# EasyEDA schematic CESC16.json

## Sheets
1 PSU: TITLE: PSU (Power Supply); REV: 1.0; Date: 2020-07-09; Sheet: 1/1
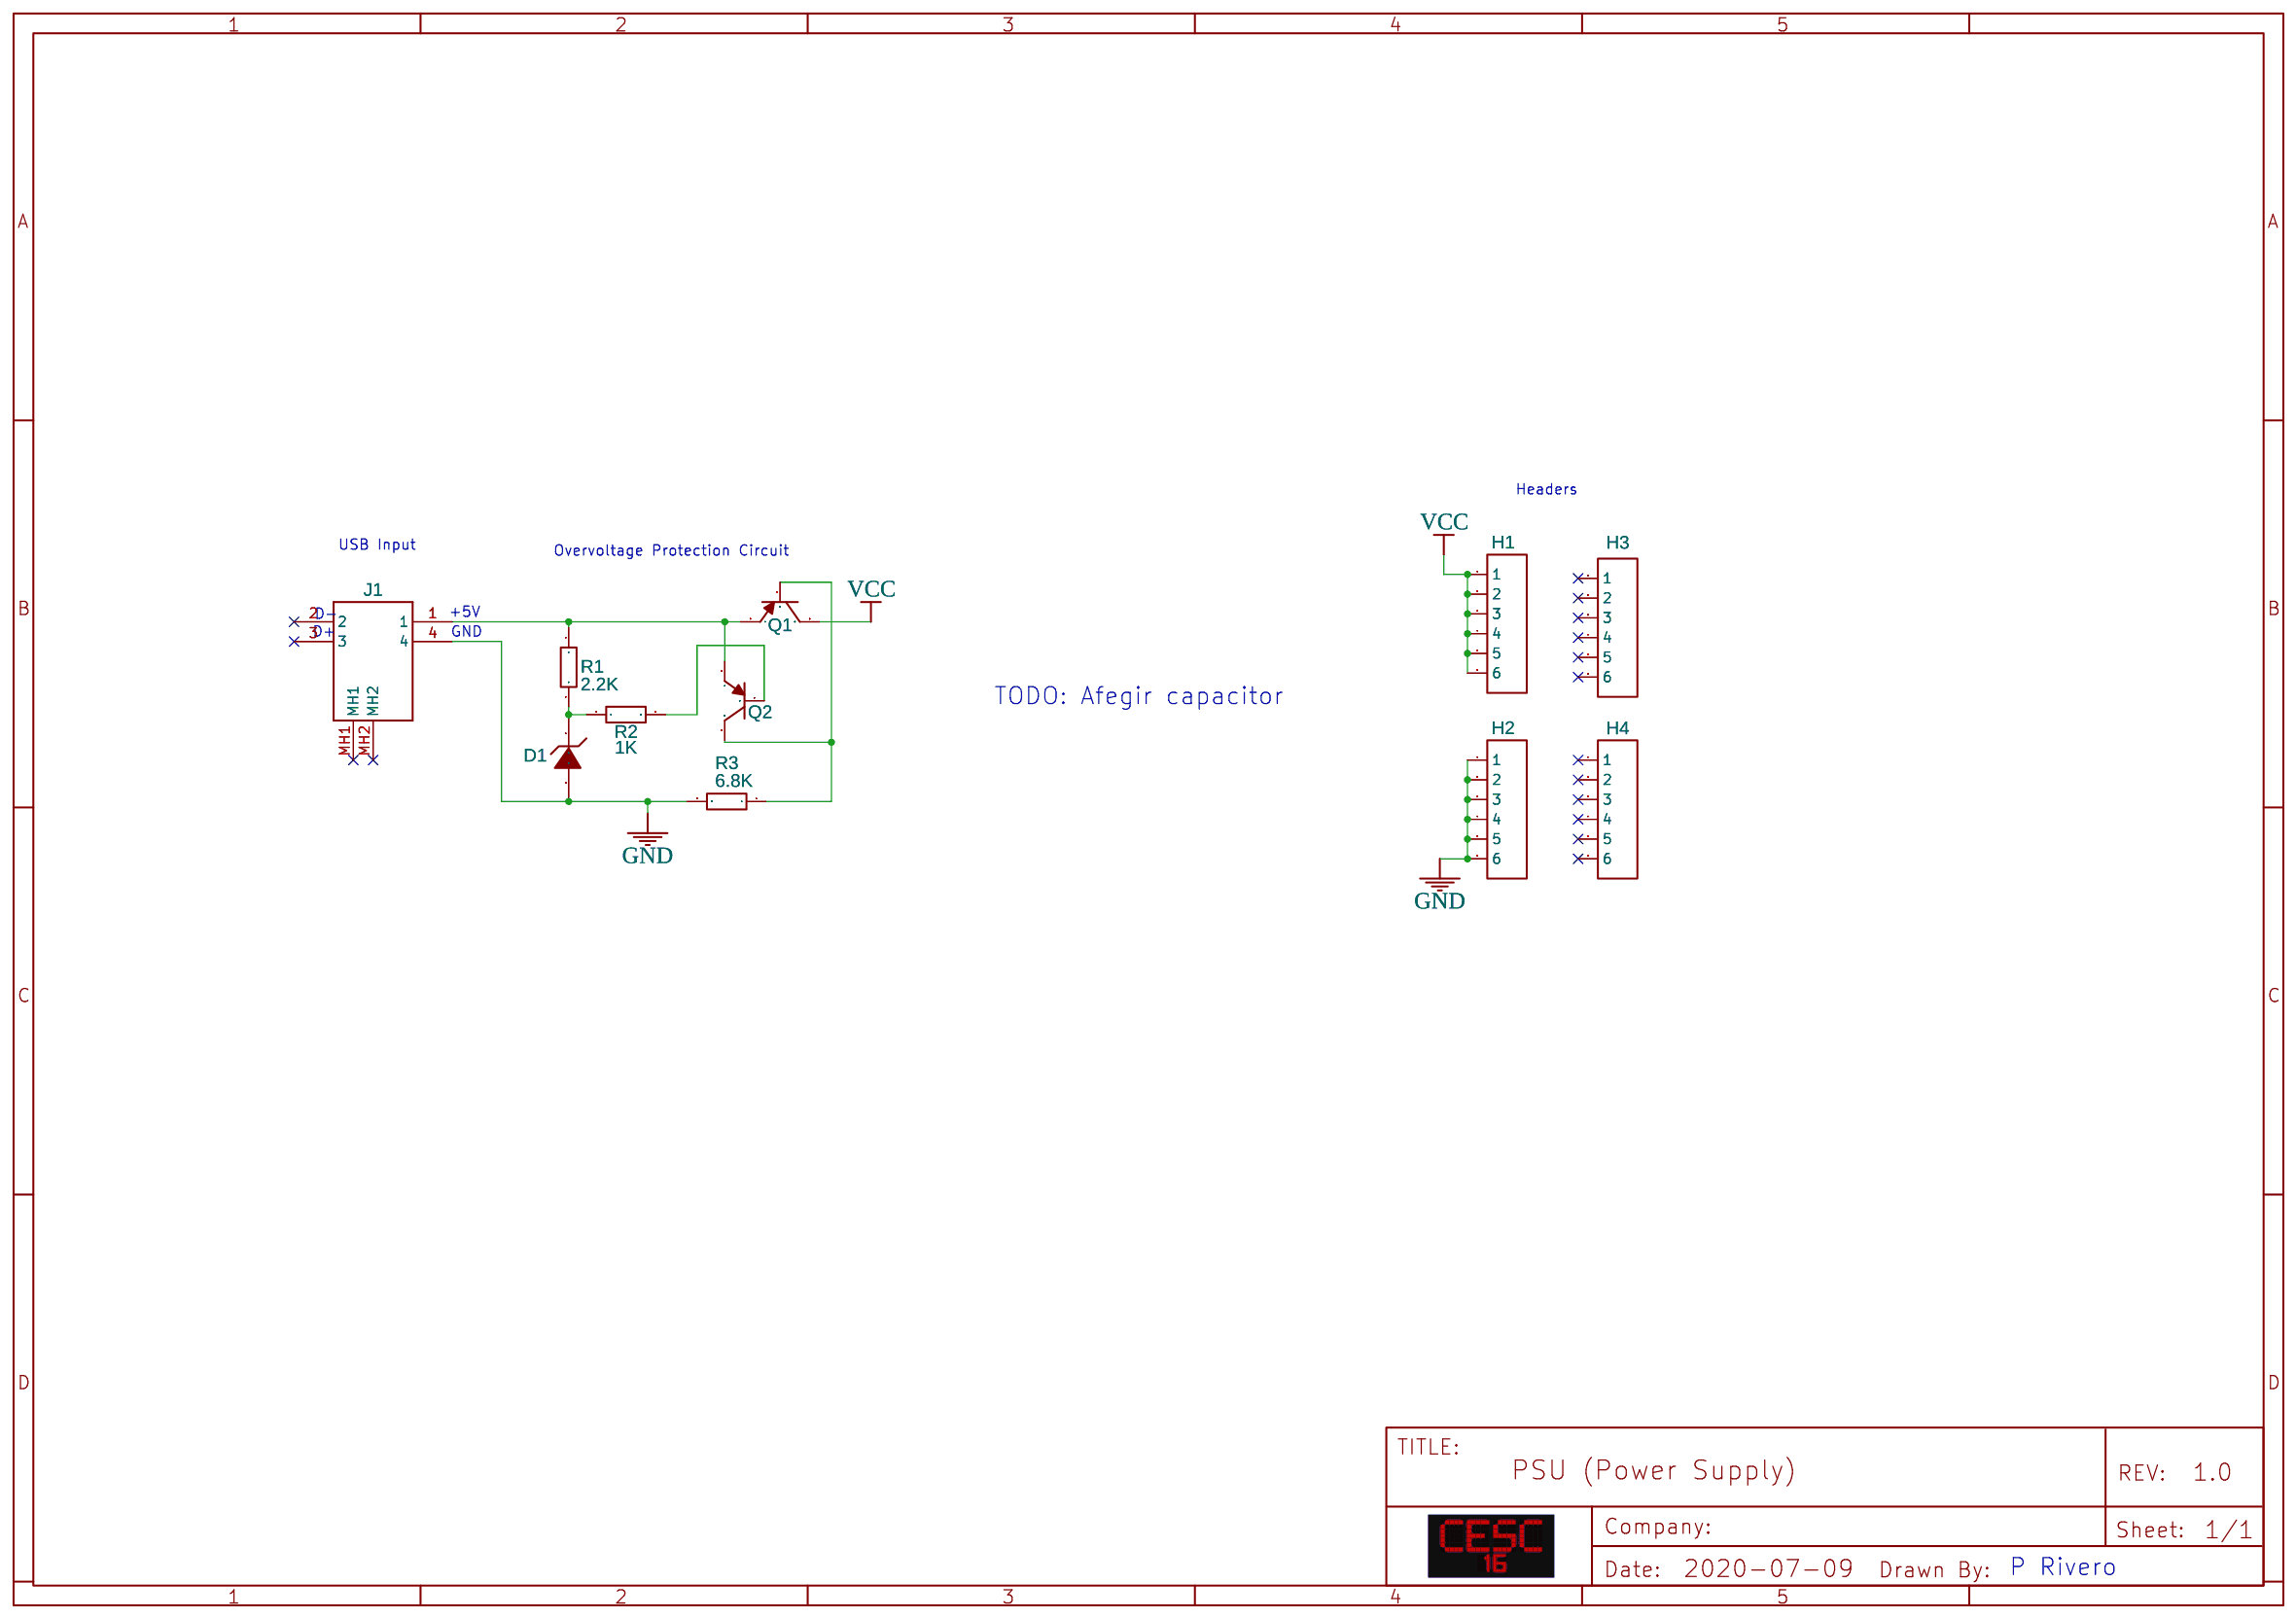
[diagram p0: PSU]
2 _Template: TITLE: Title; Date: 2020-MM-DD
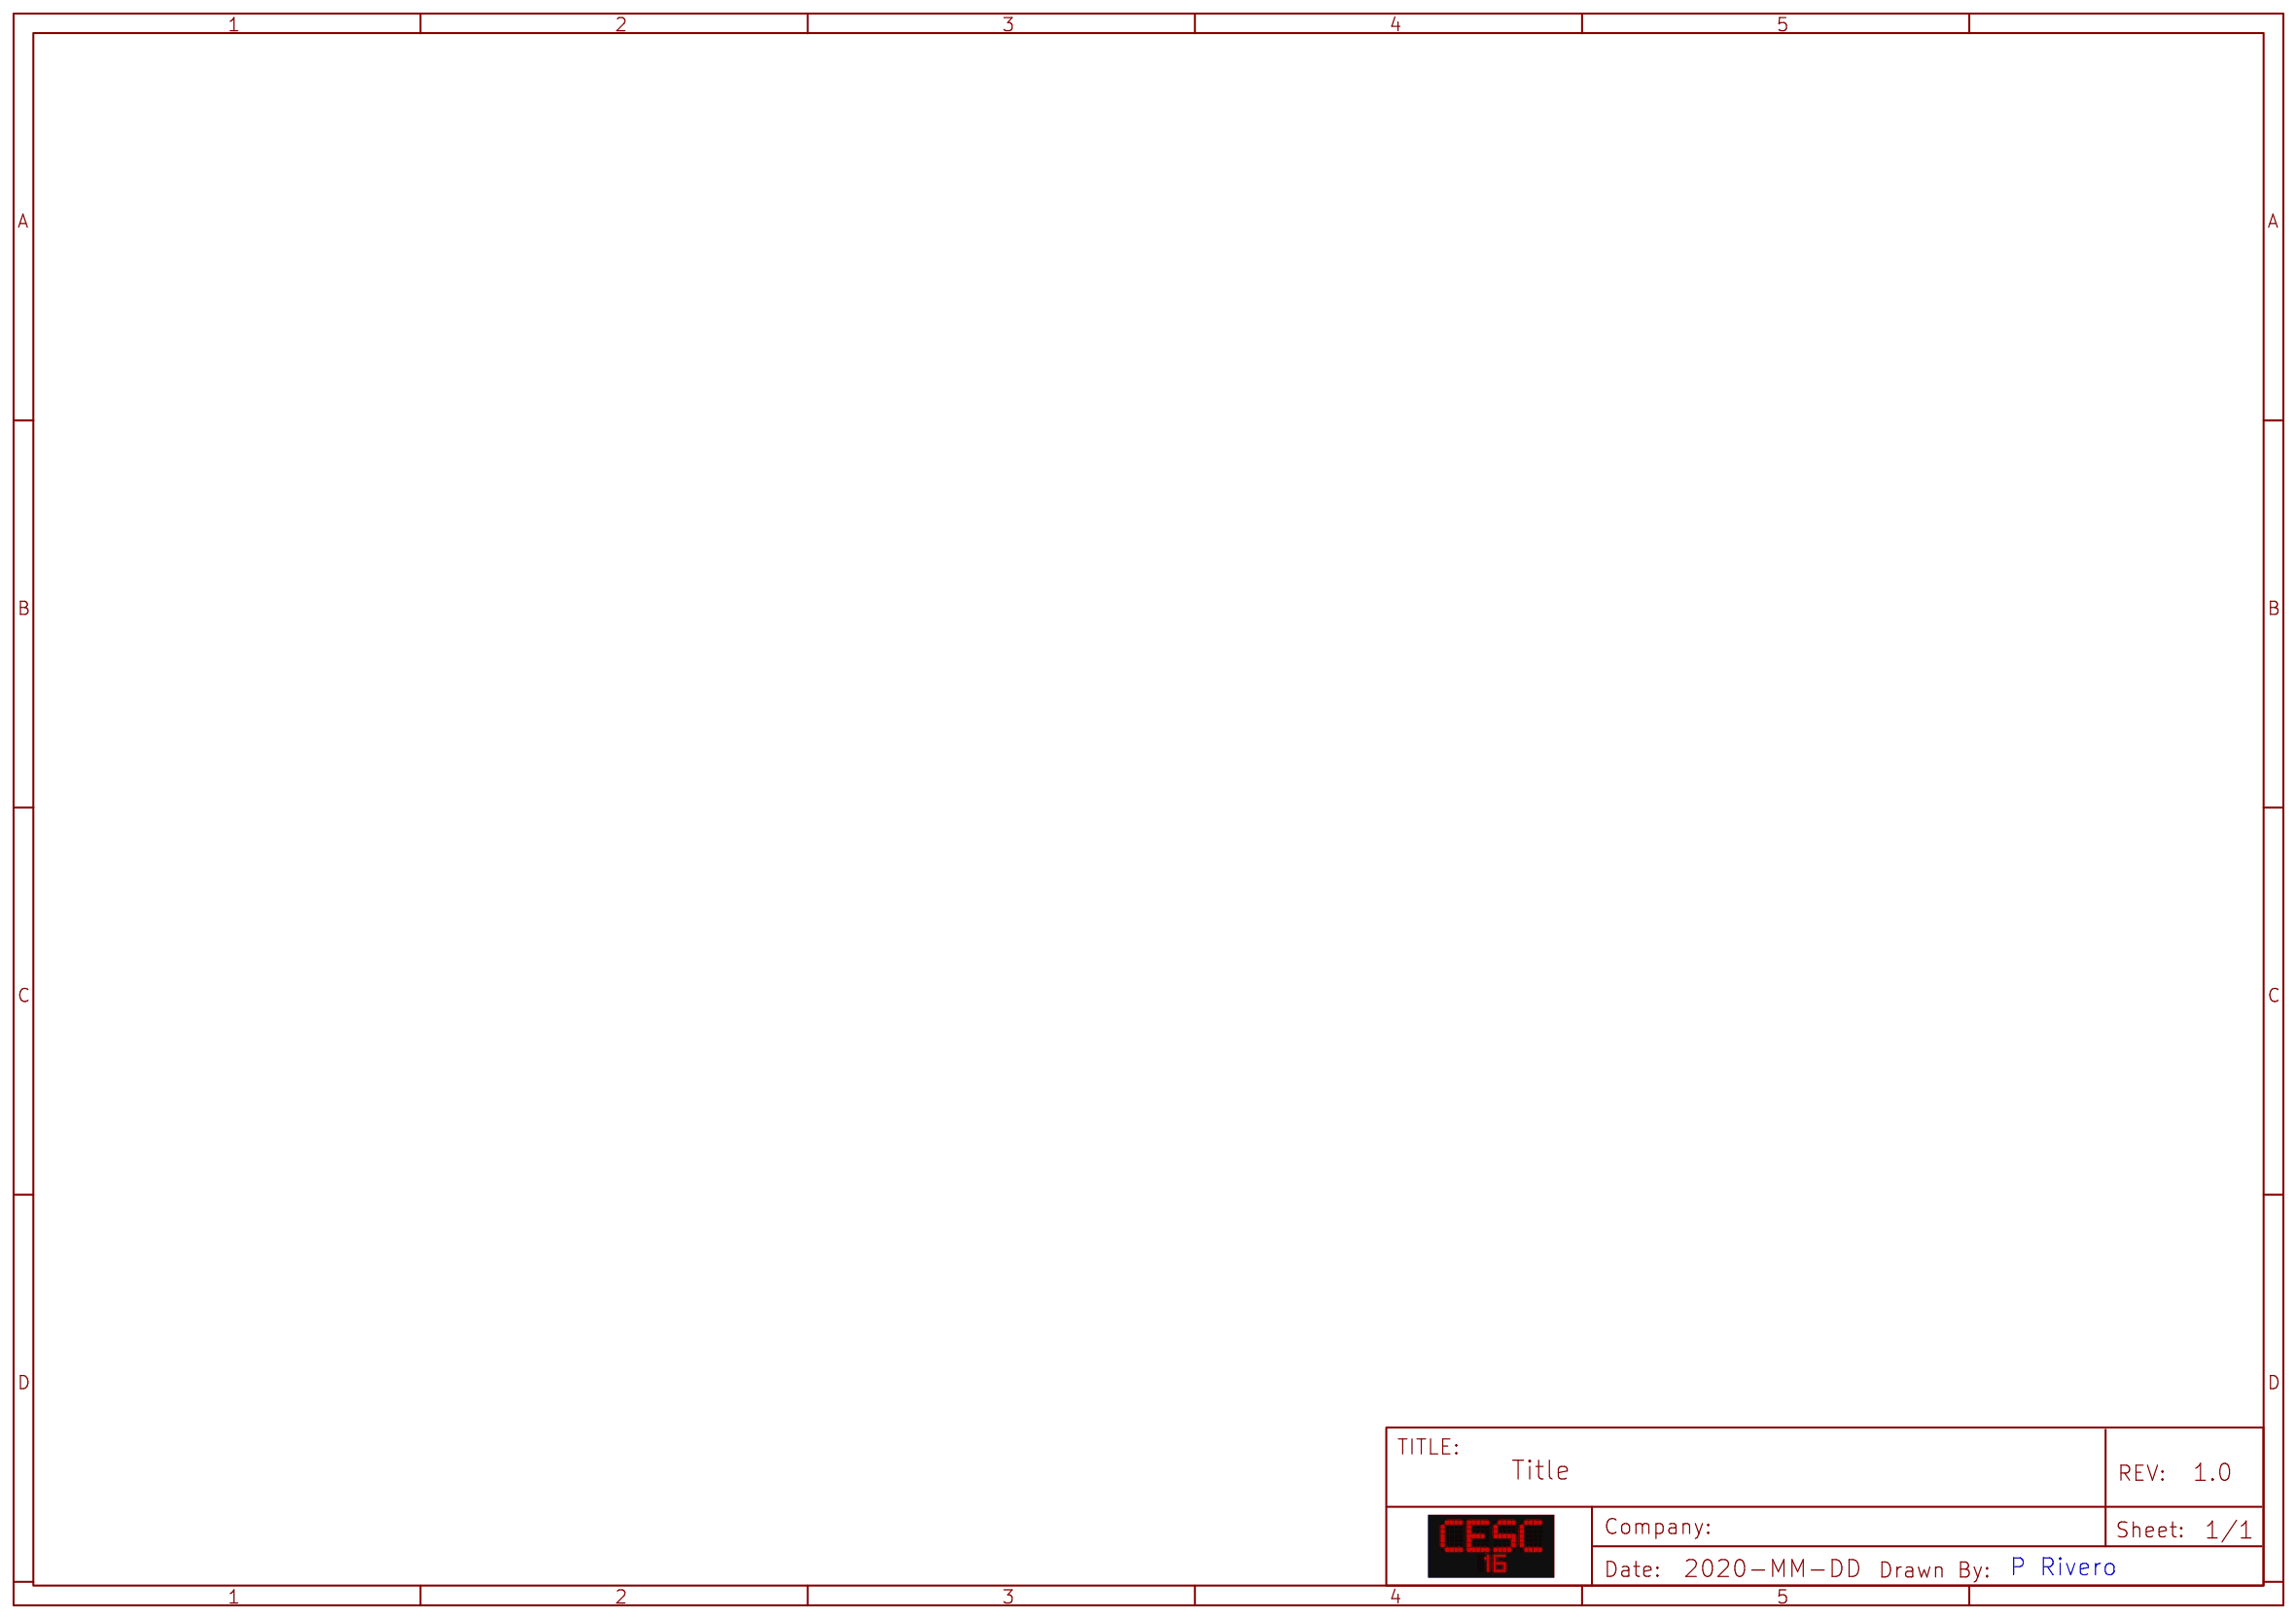
[diagram p1: _Template]
3 ALU: TITLE: ALU (Arithmetic & Logic Unit); Date: 2020-MM-DD
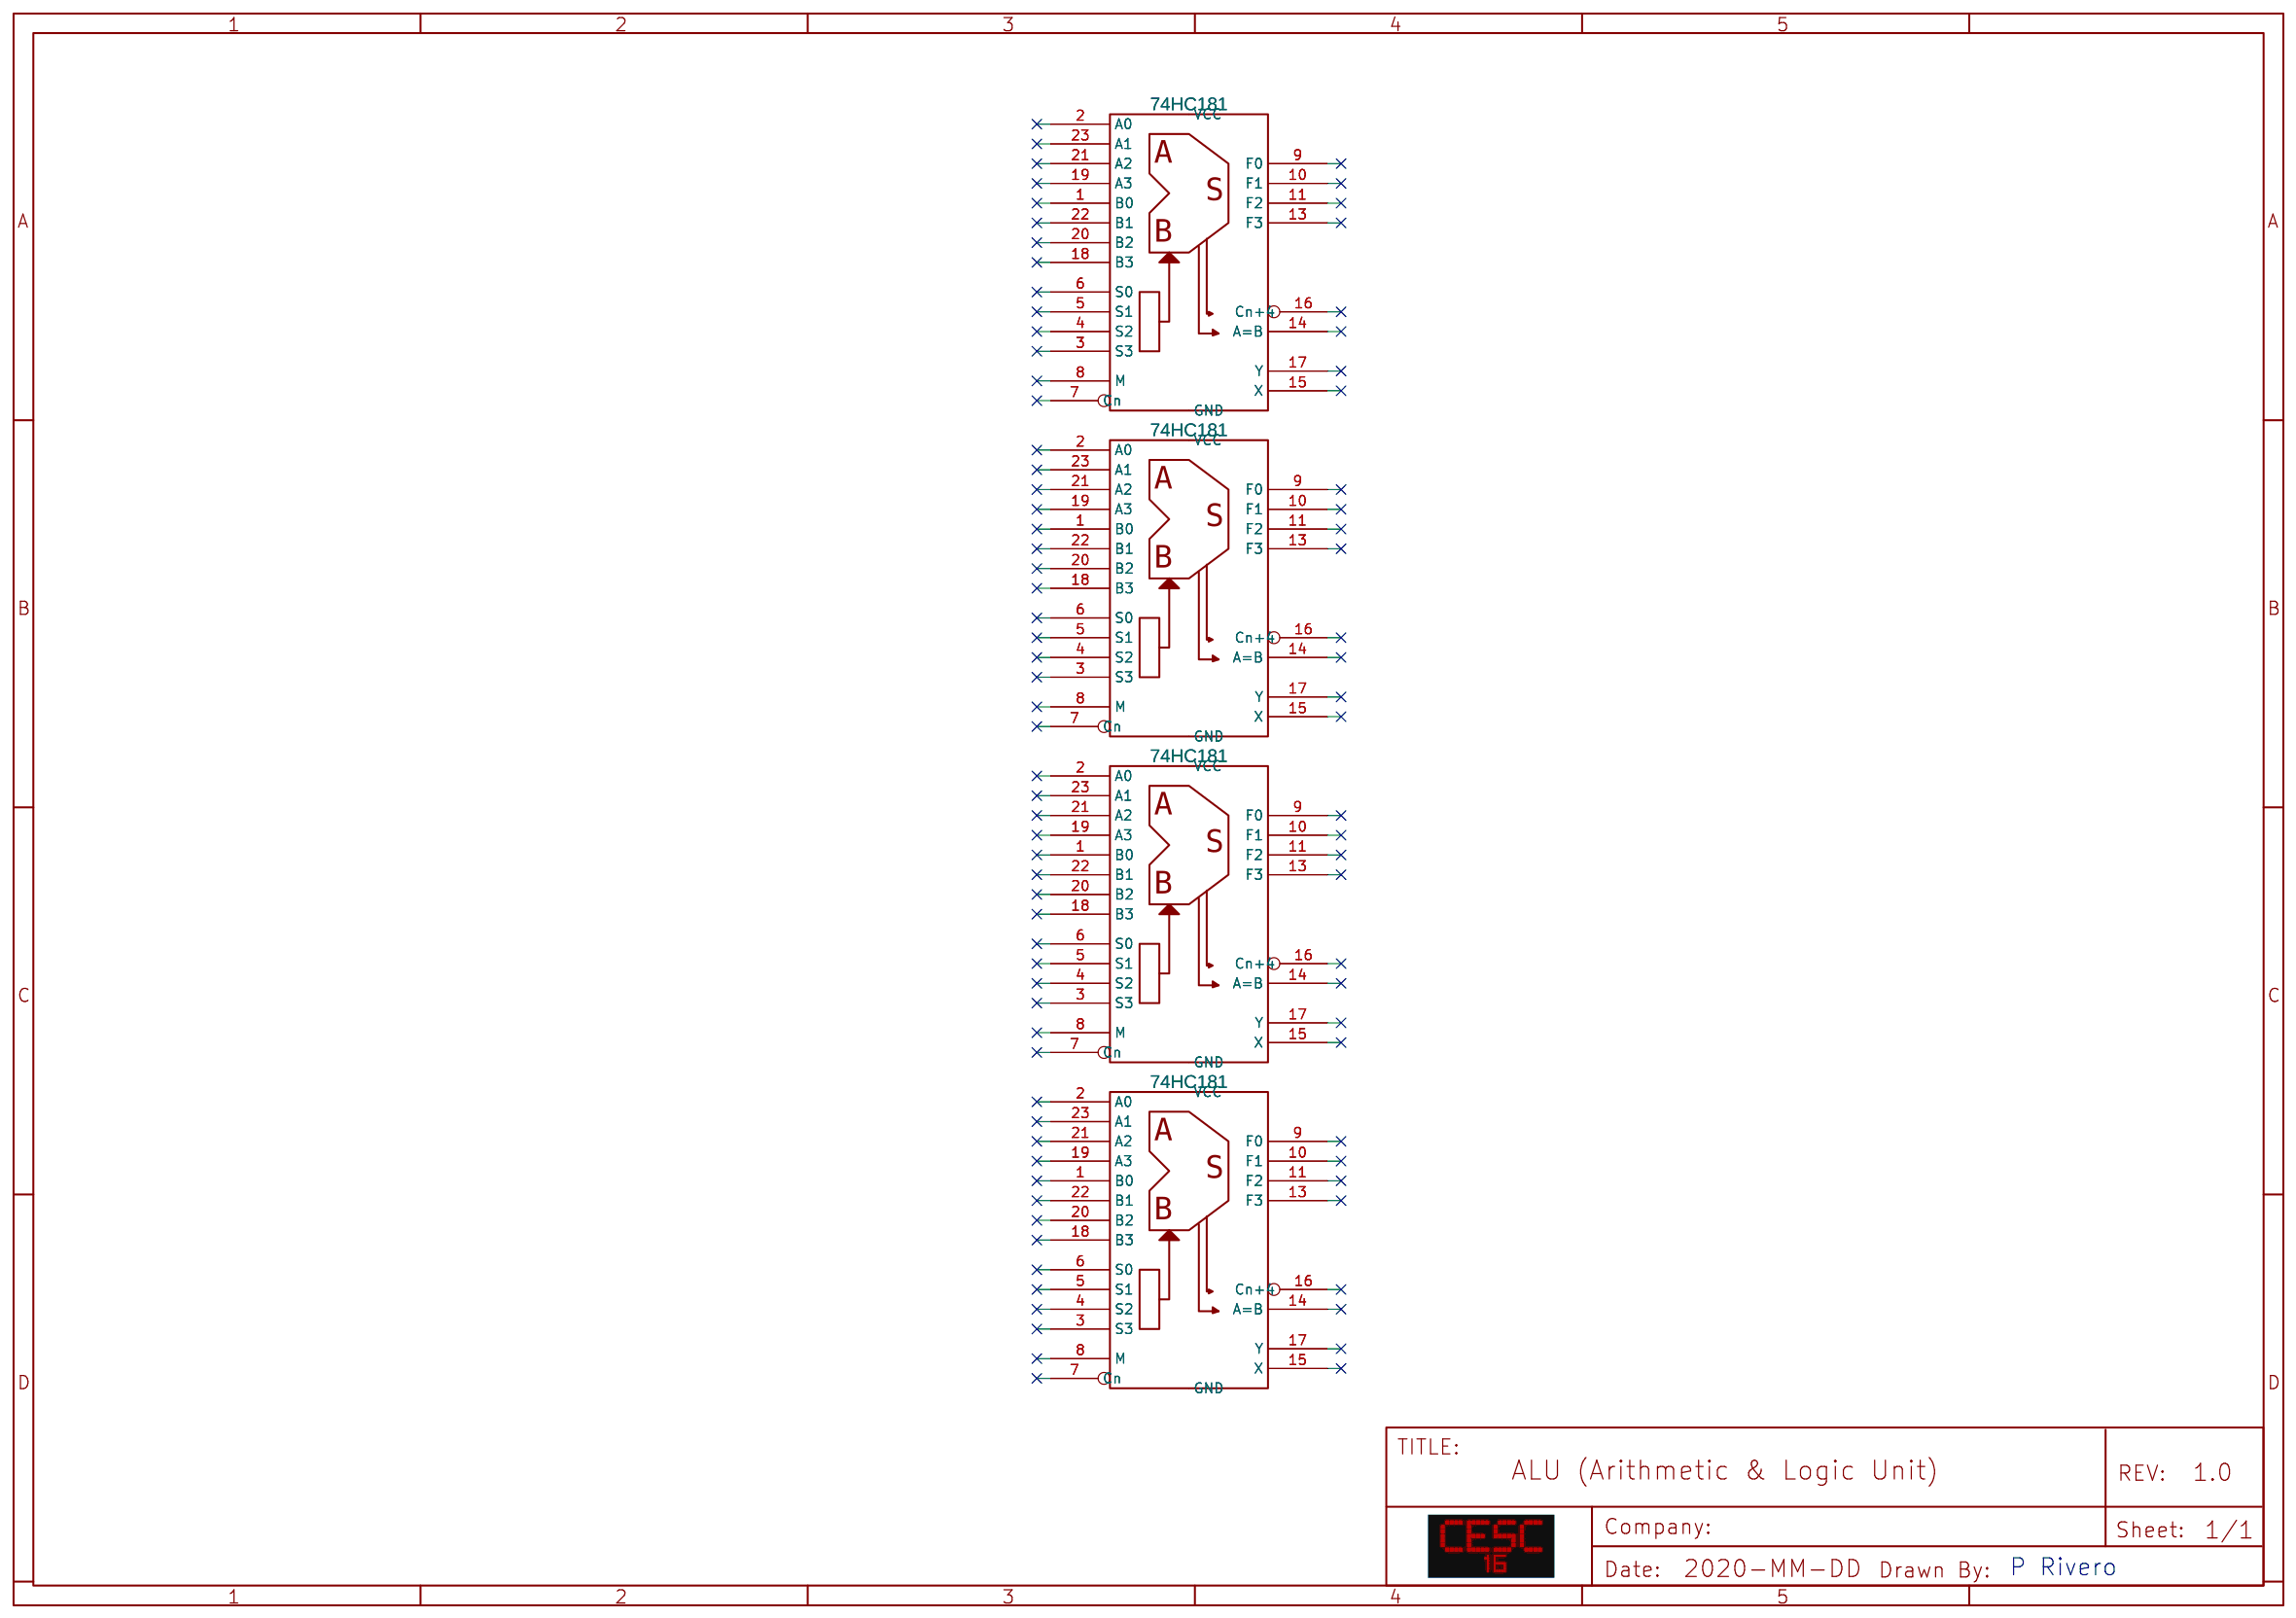
[diagram p2: ALU]
4 GPR: TITLE: GPR (General Purpose Register); Date: 2020-7-21
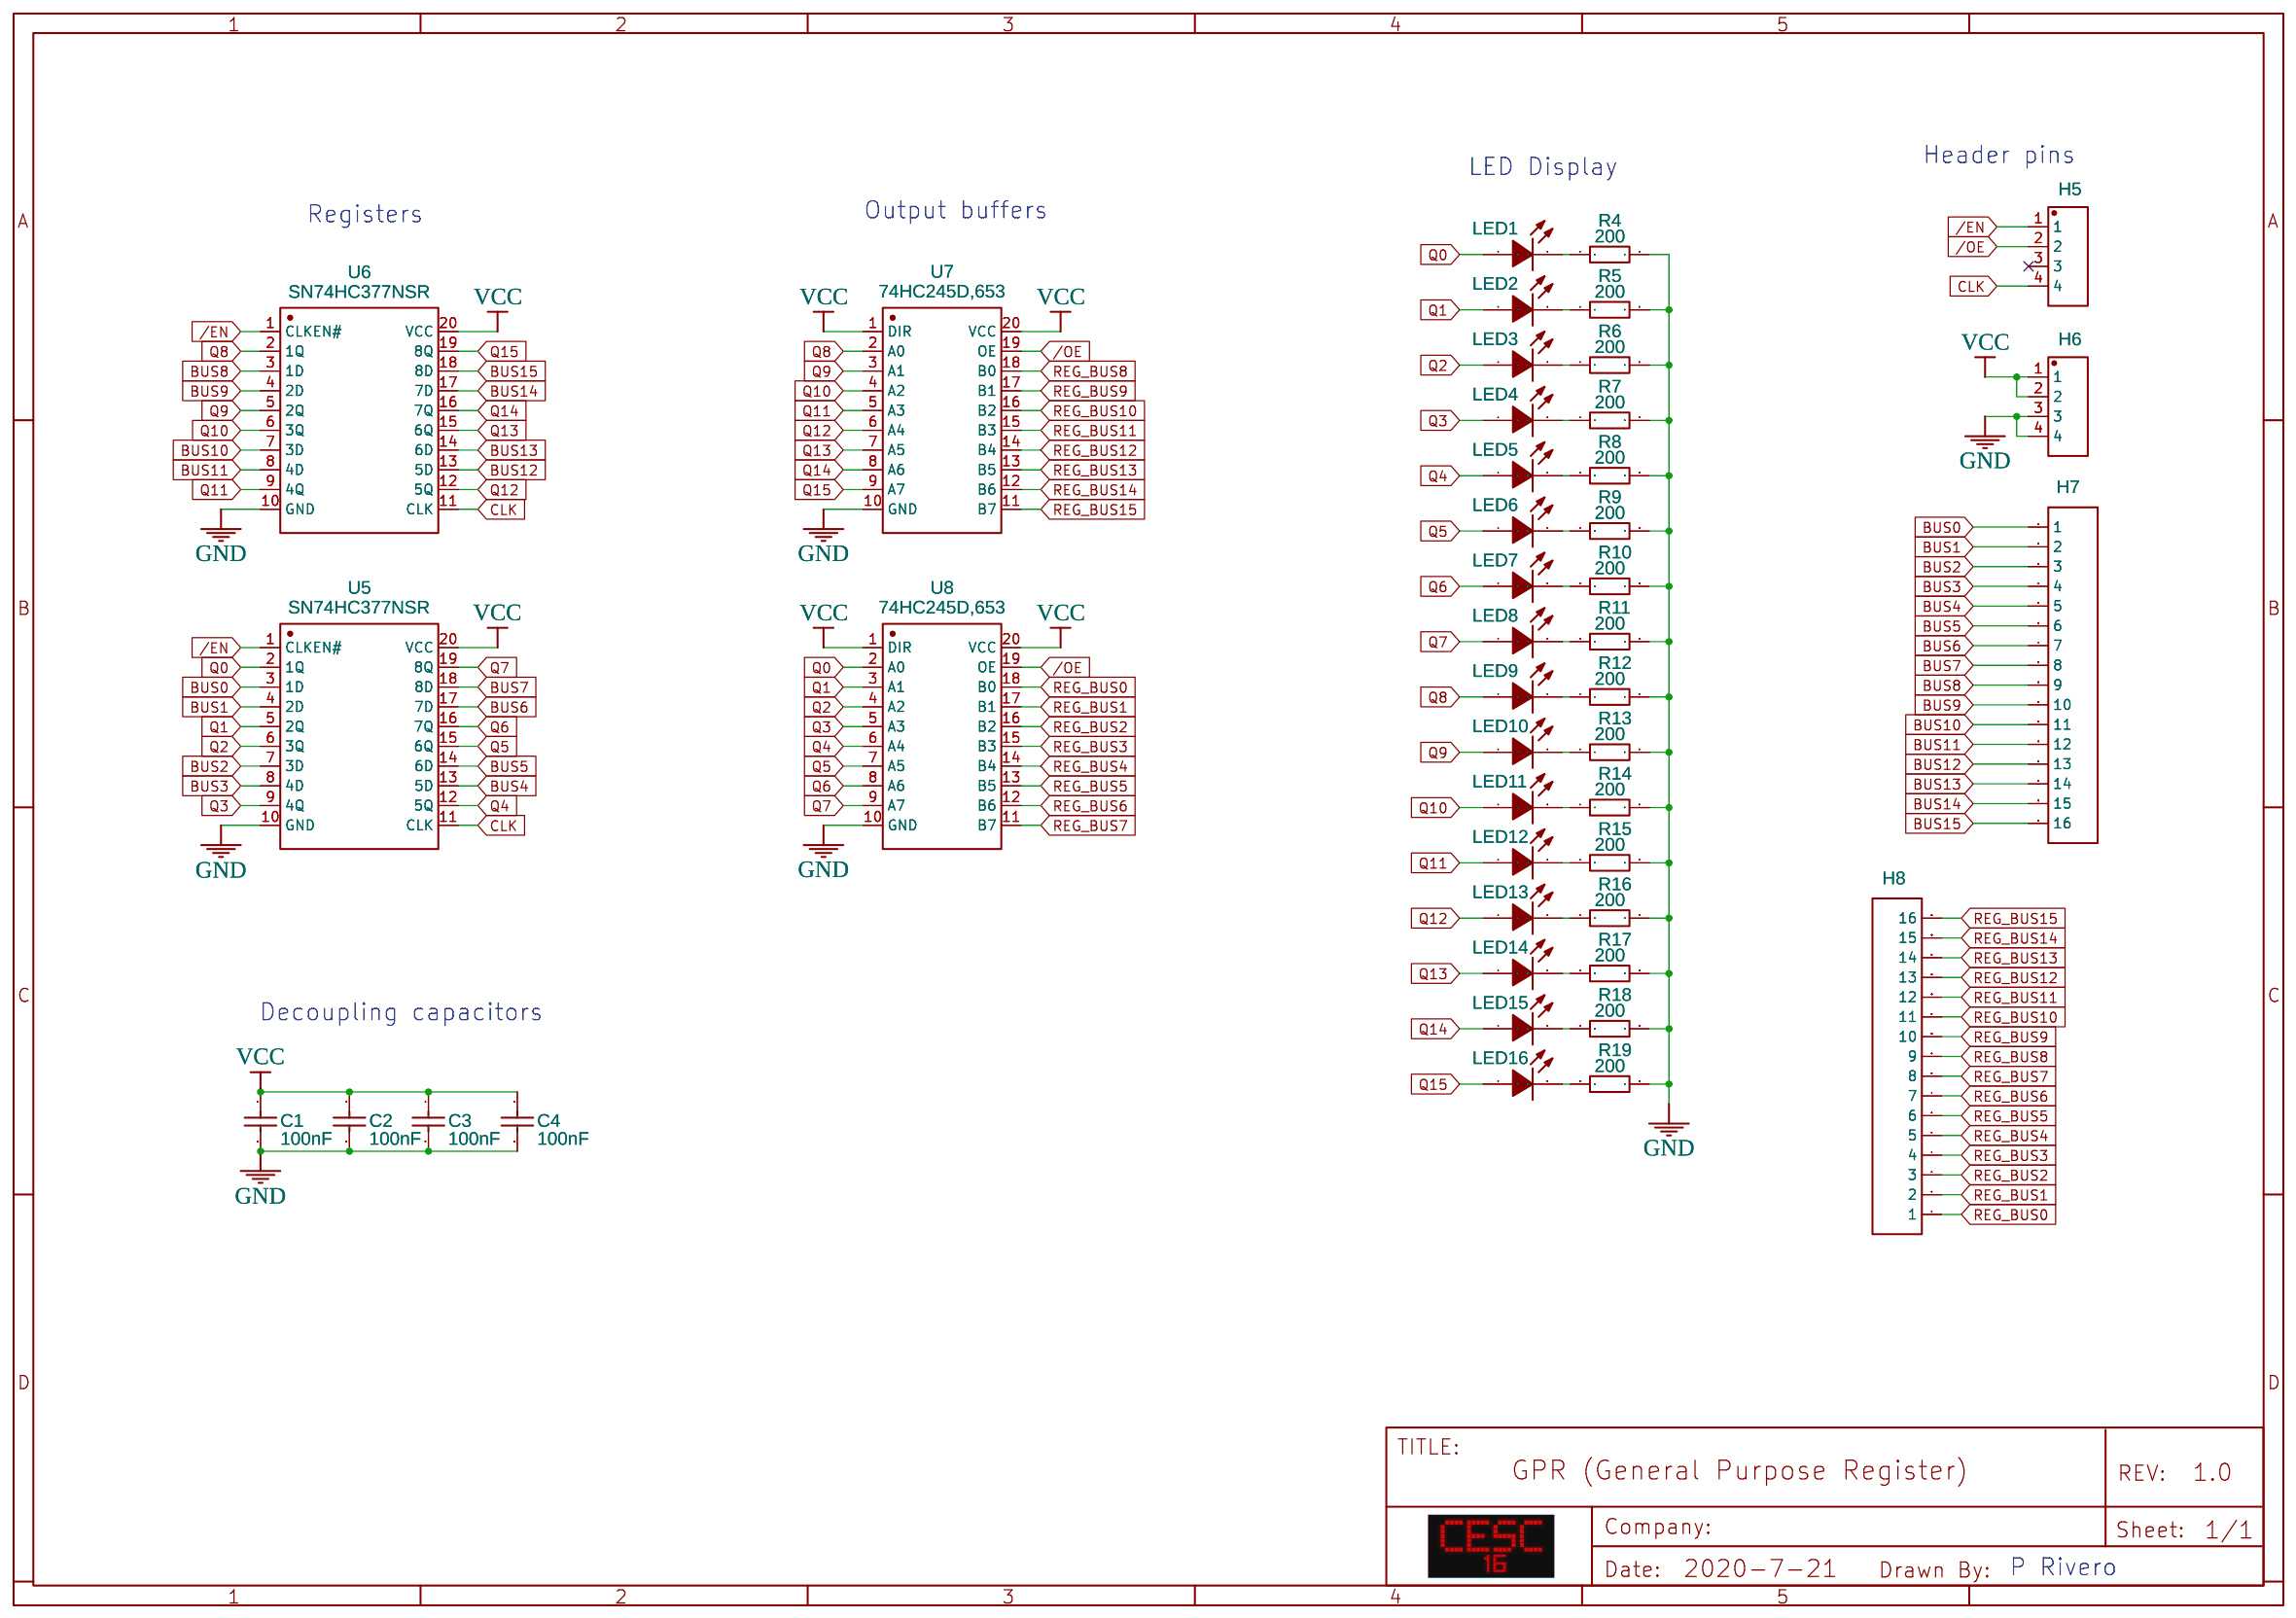
[diagram p3: GPR]

## Parts
sheet ALU
U1  74HC181  [DIP24-2.54-30.6X7.62MM]
U2  74HC181  [DIP24-2.54-30.6X7.62MM]
U3  74HC181  [DIP24-2.54-30.6X7.62MM]
U4  74HC181  [DIP24-2.54-30.6X7.62MM]
sheet GPR
C1  100nF  [C0402]
C2  100nF  [C0402]
C3  100nF  [C0402]
C4  100nF  [C0402]
H5  Header-Male-2.54_1x4_C59481  [HDR-TH_4P-P2.54-V]
H6  Header-Male-2.54_1x4_C59481  [HDR-TH_4P-P2.54-V]
H7  Header-Female-2.54_1x16  [HDR-TH_16P-P2.54-V]
H8  Header-Female-2.54_1x16  [HDR-TH_16P-P2.54-V]
LED1  KT-0603R  [LED0603-R-RD]
LED2  KT-0603R  [LED0603-R-RD]
LED3  KT-0603R  [LED0603-R-RD]
LED4  KT-0603R  [LED0603-R-RD]
LED5  KT-0603R  [LED0603-R-RD]
LED6  KT-0603R  [LED0603-R-RD]
LED7  KT-0603R  [LED0603-R-RD]
LED8  KT-0603R  [LED0603-R-RD]
LED9  KT-0603R  [LED0603-R-RD]
LED10  KT-0603R  [LED0603-R-RD]
LED11  KT-0603R  [LED0603-R-RD]
LED12  KT-0603R  [LED0603-R-RD]
LED13  KT-0603R  [LED0603-R-RD]
LED14  KT-0603R  [LED0603-R-RD]
LED15  KT-0603R  [LED0603-R-RD]
LED16  KT-0603R  [LED0603-R-RD]
R4  200  [R0603]
R5  200  [R0603]
R6  200  [R0603]
R7  200  [R0603]
R8  200  [R0603]
R9  200  [R0603]
R10  200  [R0603]
R11  200  [R0603]
R12  200  [R0603]
R13  200  [R0603]
R14  200  [R0603]
R15  200  [R0603]
R16  200  [R0603]
R17  200  [R0603]
R18  200  [R0603]
R19  200  [R0603]
U5  SN74HC377NSR  [SOIC-20_L13.3-W5.5-P1.27-LS7.8-BL]
U6  SN74HC377NSR  [SOIC-20_L13.3-W5.5-P1.27-LS7.8-BL]
U7  74HC245D,653  [SOIC-20_L13.0-W7.6-P1.27-LS10.6-BL]
U8  74HC245D,653  [SOIC-20_L13.0-W7.6-P1.27-LS10.6-BL]
sheet PSU
D1  ZMM5V6  [LL-34_L3.5-W1.5-RD]
H1  Header-Male-2.54_1x6  [HDR-TH_6P-P2.54-V]
H2  Header-Male-2.54_1x6  [HDR-TH_6P-P2.54-V]
H3  Header-Male-2.54_1x6  [HDR-TH_6P-P2.54-V]
H4  Header-Male-2.54_1x6  [HDR-TH_6P-P2.54-V]
J1  UJ2-BH-1-TH  [UJ2BH1TH]
Q1  S9012 2T1  [SOT-23-3_L2.9-W1.3-P1.90-LS2.4-BR]
Q2  S9012 2T1  [SOT-23-3_L2.9-W1.3-P1.90-LS2.4-BR]
R1  2.2K  [R0603]
R2  1K  [R0402]
R3  6.8K  [R0402]

## Library data of the parts
U1-U4 = 74LS181: Contributor: KiCAD; license: https://www.gnu.org/licenses/lgpl-2.1.html
C1-C4 = CL05B104KO5NNNC: Supplier: LCSC; Manufacturer: SAMSUNG; LCSC Assembly: Yes; Supplier Part: C1525; SMT Type: Basic
H5 H6 = Header-Male-2.54_1x4_C59481: Supplier: LCSC; Manufacturer: ReliaPro; Manufacturer Part: Headers  Pins 1*4P; image: http://image.lceda.cn/szlcsc/C59481.jpg; Supplier Part: C59481
H7 H8 = Header-Female-2.54_1x16: Supplier: LCSC; Manufacturer: BOOMELE; Manufacturer Part: Female header1*16P pitch 2.54mm; image: //image.lceda.cn/szlcsc/C66987.jpg; Supplier Part: C66987
LED1-LED16 = KT-0603R: Supplier: LCSC; Manufacturer: KENTO; LCSC Assembly: Yes; image: //image.lceda.cn/szlcsc/C2286.jpg; Supplier Part: C2286; SMT Type: Basic
R4-R19 = 0603WAF2000T5E: Supplier: LCSC; Manufacturer: UniOhm; LCSC Assembly: Yes; Supplier Part: C8218; SMT Type: Basic
U5 U6 = SN74HC377NSR: Supplier: LCSC; Manufacturer: TI; image: //image.lceda.cn/szlcsc/C7647.jpg; Supplier Part: C7647; LCSC Assembly: Yes; SMT Type: Extend
U7 U8 = 74HC245D,653: Supplier: LCSC; Manufacturer: Nexperia; LCSC Assembly: Yes; image: //image.lceda.cn/szlcsc/C5625.jpg; Supplier Part: C5625; SMT Type: Basic
D1 = ZMM5V6: Supplier: LCSC; LCSC Assembly: Yes; Manufacturer: SEMTECH; image: //image.lceda.cn/szlcsc/C8062.jpg; Supplier Part: C8062; SMT Type: Basic
H1-H4 = Header-Male-2.54_1x6: Supplier: LCSC; Manufacturer: BOOMELE; Supplier Part: C37208
J1 = UJ2-BH-1-TH: Contributor: Pol Rivero
Q1 Q2 = S9012 2T1: Supplier: LCSC; Manufacturer: CJ; image: //image.lceda.cn/szlcsc/C8543.jpg; Supplier Part: C8543; LCSC Assembly: Yes; SMT Type: Basic
R1 = 0603WAF2201T5E: Supplier: LCSC; Manufacturer: UniOhm; LCSC Assembly: Yes; Supplier Part: C4190; SMT Type: Basic
R2 = 0402WGF1001TCE: Supplier: LCSC; Manufacturer: UniOhm; LCSC Assembly: Yes; Supplier Part: C11702; SMT Type: Basic
R3 = 0402WGF6801TCE: Supplier: LCSC; Manufacturer: UniOhm; LCSC Assembly: Yes; Supplier Part: C25917; SMT Type: Basic

## Nets
GND: C1.2 C2.2 C3.2 C4.2 D1.2(A) H2.1 H2.2 H2.3 H2.4 H2.5 H2.6 H6.3 H6.4 J1.4 R3.2 R4.2 R5.2 R6.2 R7.2 R8.2 R9.2 R10.2 R11.2 R12.2 R13.2 R14.2 R15.2 R16.2 R17.2 R18.2 R19.2 U5.10(GND) U6.10(GND) U7.10(GND) U8.10(GND)
VCC: C1.1 C2.1 C3.1 C4.1 H1.1 H1.2 H1.3 H1.4 H1.5 H1.6 H6.1 H6.2 Q1.3(C) U5.20(VCC) U6.20(VCC) U7.1(DIR) U7.20(VCC) U8.1(DIR) U8.20(VCC)
/EN: H5.1 U5.1(CLKEN#) U6.1(CLKEN#)
/OE: H5.2 U7.19(OE) U8.19(OE)
BUS0: H7.1 U5.3(1D)
BUS1: H7.2 U5.4(2D)
BUS2: H7.3 U5.7(3D)
BUS3: H7.4 U5.8(4D)
BUS4: H7.5 U5.13(5D)
BUS5: H7.6 U5.14(6D)
BUS6: H7.7 U5.17(7D)
BUS7: H7.8 U5.18(8D)
BUS8: H7.9 U6.3(1D)
BUS9: H7.10 U6.4(2D)
BUS10: H7.11 U6.7(3D)
BUS11: H7.12 U6.8(4D)
BUS12: H7.13 U6.13(5D)
BUS13: H7.14 U6.14(6D)
BUS14: H7.15 U6.17(7D)
BUS15: H7.16 U6.18(8D)
CLK: H5.4 U5.11(CLK) U6.11(CLK)
Q0: LED1.1(A) U5.2(1Q) U8.2(A0)
Q1: LED2.1(A) U5.5(2Q) U8.3(A1)
Q2: LED3.1(A) U5.6(3Q) U8.4(A2)
Q3: LED4.1(A) U5.9(4Q) U8.5(A3)
Q4: LED5.1(A) U5.12(5Q) U8.6(A4)
Q5: LED6.1(A) U5.15(6Q) U8.7(A5)
Q6: LED7.1(A) U5.16(7Q) U8.8(A6)
Q7: LED8.1(A) U5.19(8Q) U8.9(A7)
Q8: LED9.1(A) U6.2(1Q) U7.2(A0)
Q9: LED10.1(A) U6.5(2Q) U7.3(A1)
Q10: LED11.1(A) U6.6(3Q) U7.4(A2)
Q11: LED12.1(A) U6.9(4Q) U7.5(A3)
Q12: LED13.1(A) U6.12(5Q) U7.6(A4)
Q13: LED14.1(A) U6.15(6Q) U7.7(A5)
Q14: LED15.1(A) U6.16(7Q) U7.8(A6)
Q15: LED16.1(A) U6.19(8Q) U7.9(A7)
REG_BUS0: H8.1 U8.18(B0)
REG_BUS1: H8.2 U8.17(B1)
REG_BUS2: H8.3 U8.16(B2)
REG_BUS3: H8.4 U8.15(B3)
REG_BUS4: H8.5 U8.14(B4)
REG_BUS5: H8.6 U8.13(B5)
REG_BUS6: H8.7 U8.12(B6)
REG_BUS7: H8.8 U8.11(B7)
REG_BUS8: H8.9 U7.18(B0)
REG_BUS9: H8.10 U7.17(B1)
REG_BUS10: H8.11 U7.16(B2)
REG_BUS11: H8.12 U7.15(B3)
REG_BUS12: H8.13 U7.14(B4)
REG_BUS13: H8.14 U7.13(B5)
REG_BUS14: H8.15 U7.12(B6)
REG_BUS15: H8.16 U7.11(B7)
Net-(D1-1): D1.1(C) R1.2 R2.1
Net-(J1-1): J1.1 Q1.2(E) Q2.2(E) R1.1
Net-(LED1-2): LED1.2(K) R4.1
Net-(LED2-2): LED2.2(K) R5.1
Net-(LED3-2): LED3.2(K) R6.1
Net-(LED4-2): LED4.2(K) R7.1
Net-(LED5-2): LED5.2(K) R8.1
Net-(LED6-2): LED6.2(K) R9.1
Net-(LED7-2): LED7.2(K) R10.1
Net-(LED8-2): LED8.2(K) R11.1
Net-(LED9-2): LED9.2(K) R12.1
Net-(LED10-2): LED10.2(K) R13.1
Net-(LED11-2): LED11.2(K) R14.1
Net-(LED12-2): LED12.2(K) R15.1
Net-(LED13-2): LED13.2(K) R16.1
Net-(LED14-2): LED14.2(K) R17.1
Net-(LED15-2): LED15.2(K) R18.1
Net-(LED16-2): LED16.2(K) R19.1
Net-(Q1-1): Q1.1(B) Q2.3(C) R3.1
Net-(Q2-1): Q2.1(B) R2.2

Not connected (* = marked no-connect by the designer): H3 1* 2* 3* 4* 5* 6*; H4 1* 2* 3* 4* 5* 6*; H5 3*; J1 2* 3* MH1* MH2*; U1 1(B0) 2(A0) 3(S3) 4(S2) 5(S1) 6(S0) 7(Cn) 8(M) 9(F0) 10(F1) 11(F2) 12(GND) 13(F3) 14(A=B) 15(X) 16(Cn+4) 17(Y) 18(B3) 19(A3) 20(B2) 21(A2) 22(B1) 23(A1) 24(VCC); U2 1(B0) 2(A0) 3(S3) 4(S2) 5(S1) 6(S0) 7(Cn) 8(M) 9(F0) 10(F1) 11(F2) 12(GND) 13(F3) 14(A=B) 15(X) 16(Cn+4) 17(Y) 18(B3) 19(A3) 20(B2) 21(A2) 22(B1) 23(A1) 24(VCC); U3 1(B0) 2(A0) 3(S3) 4(S2) 5(S1) 6(S0) 7(Cn) 8(M) 9(F0) 10(F1) 11(F2) 12(GND) 13(F3) 14(A=B) 15(X) 16(Cn+4) 17(Y) 18(B3) 19(A3) 20(B2) 21(A2) 22(B1) 23(A1) 24(VCC); U4 1(B0) 2(A0) 3(S3) 4(S2) 5(S1) 6(S0) 7(Cn) 8(M) 9(F0) 10(F1) 11(F2) 12(GND) 13(F3) 14(A=B) 15(X) 16(Cn+4) 17(Y) 18(B3) 19(A3) 20(B2) 21(A2) 22(B1) 23(A1) 24(VCC)

## Notes on the sheets
sheet 1
- Headers
- USB Input
- Overvoltage Protection Circuit
- D-
- +5V
- D+
- GND
- TODO: Afegir capacitor
- P Rivero
sheet 2
- P Rivero
sheet 3
- P Rivero
sheet 4
- LED Display
- Header pins
- Registers
- Output buffers
- Decoupling capacitors
- P Rivero
